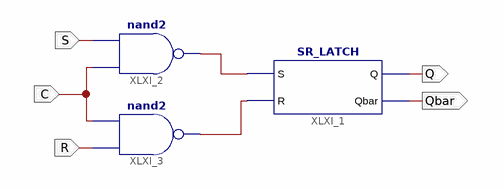
[diagram p0: schematic sheet 1]
// Xilinx ISE schematic CSR_LATCH.sch (artix7) as structural Verilog: 3 symbols, 5 ports
module CSR_LATCH (
  input  C,
  input  S,
  input  R,
  output Q,
  output Qbar
);

  wire XLXN_1, XLXN_2;

  SR_LATCH XLXI_1 (.S(XLXN_1), .R(XLXN_2), .Q(Q), .Qbar(Qbar));
  nand XLXI_2 (XLXN_1, C, S);
  nand XLXI_3 (XLXN_2, R, C);
endmodule
